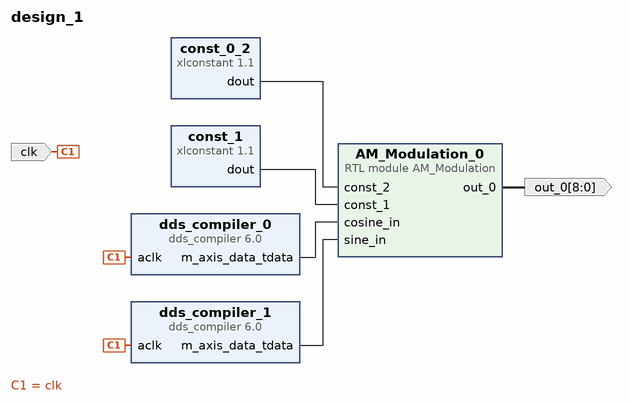
[diagram p0: block diagram of the top level]
# Vivado block design design_1, xc7z020clg400-1, Vivado 2021.2
create_bd_design design_1

create_bd_port -dir O -from 8 -to 0 out_0
create_bd_port -dir I -type clk clk

create_bd_cell -type ip -vlnv xilinx.com:ip:dds_compiler:6.0 dds_compiler_0
set_property -dict [list \
  CONFIG.Has_Phase_Out false \
  CONFIG.M_DATA_Has_TUSER Not_Required \
  CONFIG.Noise_Shaping None \
  CONFIG.Output_Frequency1 0 \
  CONFIG.Output_Selection Cosine \
  CONFIG.Output_Width 8 \
  CONFIG.PINC1 00011001 \
  CONFIG.Parameter_Entry Hardware_Parameters \
  CONFIG.Phase_Width 28 \
] [get_bd_cells dds_compiler_0]
create_bd_cell -type ip -vlnv xilinx.com:ip:dds_compiler:6.0 dds_compiler_1
set_property -dict [list \
  CONFIG.Has_Phase_Out false \
  CONFIG.M_DATA_Has_TUSER Not_Required \
  CONFIG.Noise_Shaping None \
  CONFIG.Output_Frequency1 0 \
  CONFIG.Output_Selection Sine \
  CONFIG.Output_Width 8 \
  CONFIG.PINC1 00011100001011100011 \
  CONFIG.Parameter_Entry Hardware_Parameters \
  CONFIG.Phase_Width 28 \
] [get_bd_cells dds_compiler_1]
create_bd_cell -type ip -vlnv xilinx.com:ip:xlconstant:1.1 const_0_2
set_property -dict {CONFIG.CONST_VAL 128 CONFIG.CONST_WIDTH 9} [get_bd_cells const_0_2]
create_bd_cell -type ip -vlnv xilinx.com:ip:xlconstant:1.1 const_1
set_property -dict {CONFIG.CONST_VAL 51 CONFIG.CONST_WIDTH 9} [get_bd_cells const_1]
create_bd_cell -type module -reference AM_Modulation AM_Modulation_0

# ---- connections ----

connect_bd_net [get_bd_pins AM_Modulation_0/out_0] [get_bd_ports out_0]
connect_bd_net -net aclk_0_1 [get_bd_ports clk] [get_bd_pins dds_compiler_0/aclk] [get_bd_pins dds_compiler_1/aclk]
connect_bd_net [get_bd_pins const_0_2/dout] [get_bd_pins AM_Modulation_0/const_2]
connect_bd_net [get_bd_pins const_1/dout] [get_bd_pins AM_Modulation_0/const_1]
connect_bd_net [get_bd_pins dds_compiler_0/m_axis_data_tdata] [get_bd_pins AM_Modulation_0/cosine_in]
connect_bd_net [get_bd_pins dds_compiler_1/m_axis_data_tdata] [get_bd_pins AM_Modulation_0/sine_in]

validate_bd_design
save_bd_design
